# EAGLE schematic eletrio01 (EAGLE 7.3.0)

## Sheet 1 of 2
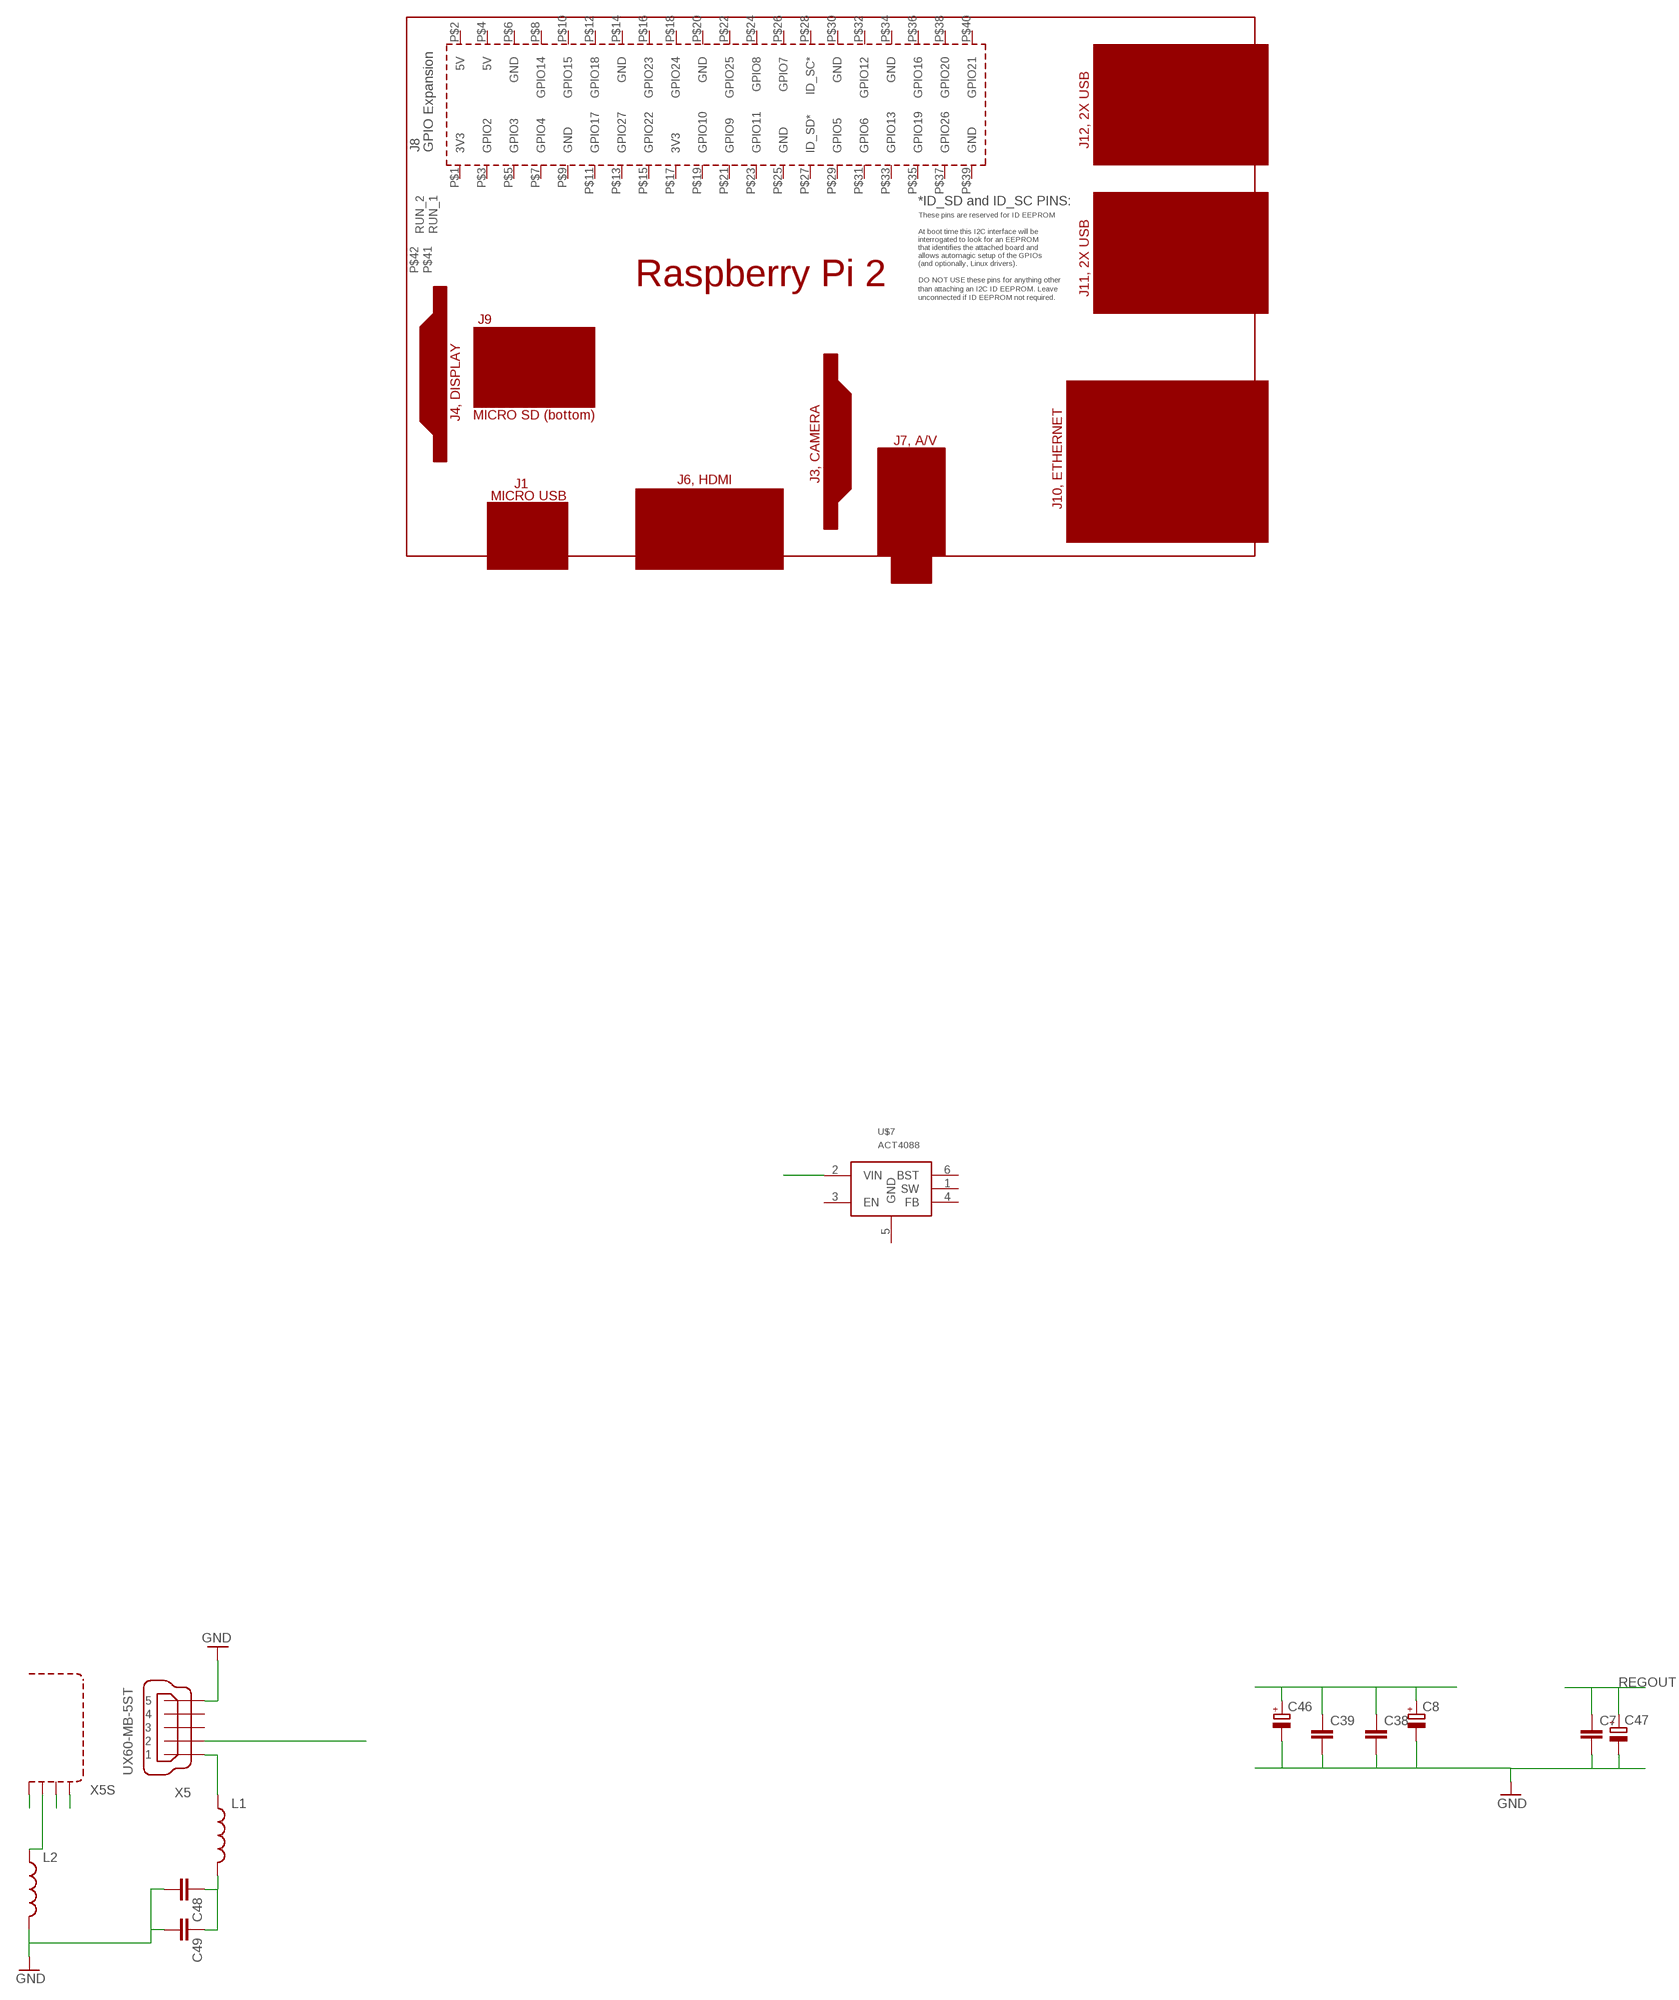
[diagram p0: schematic, sheet 1, part 1 of 3]
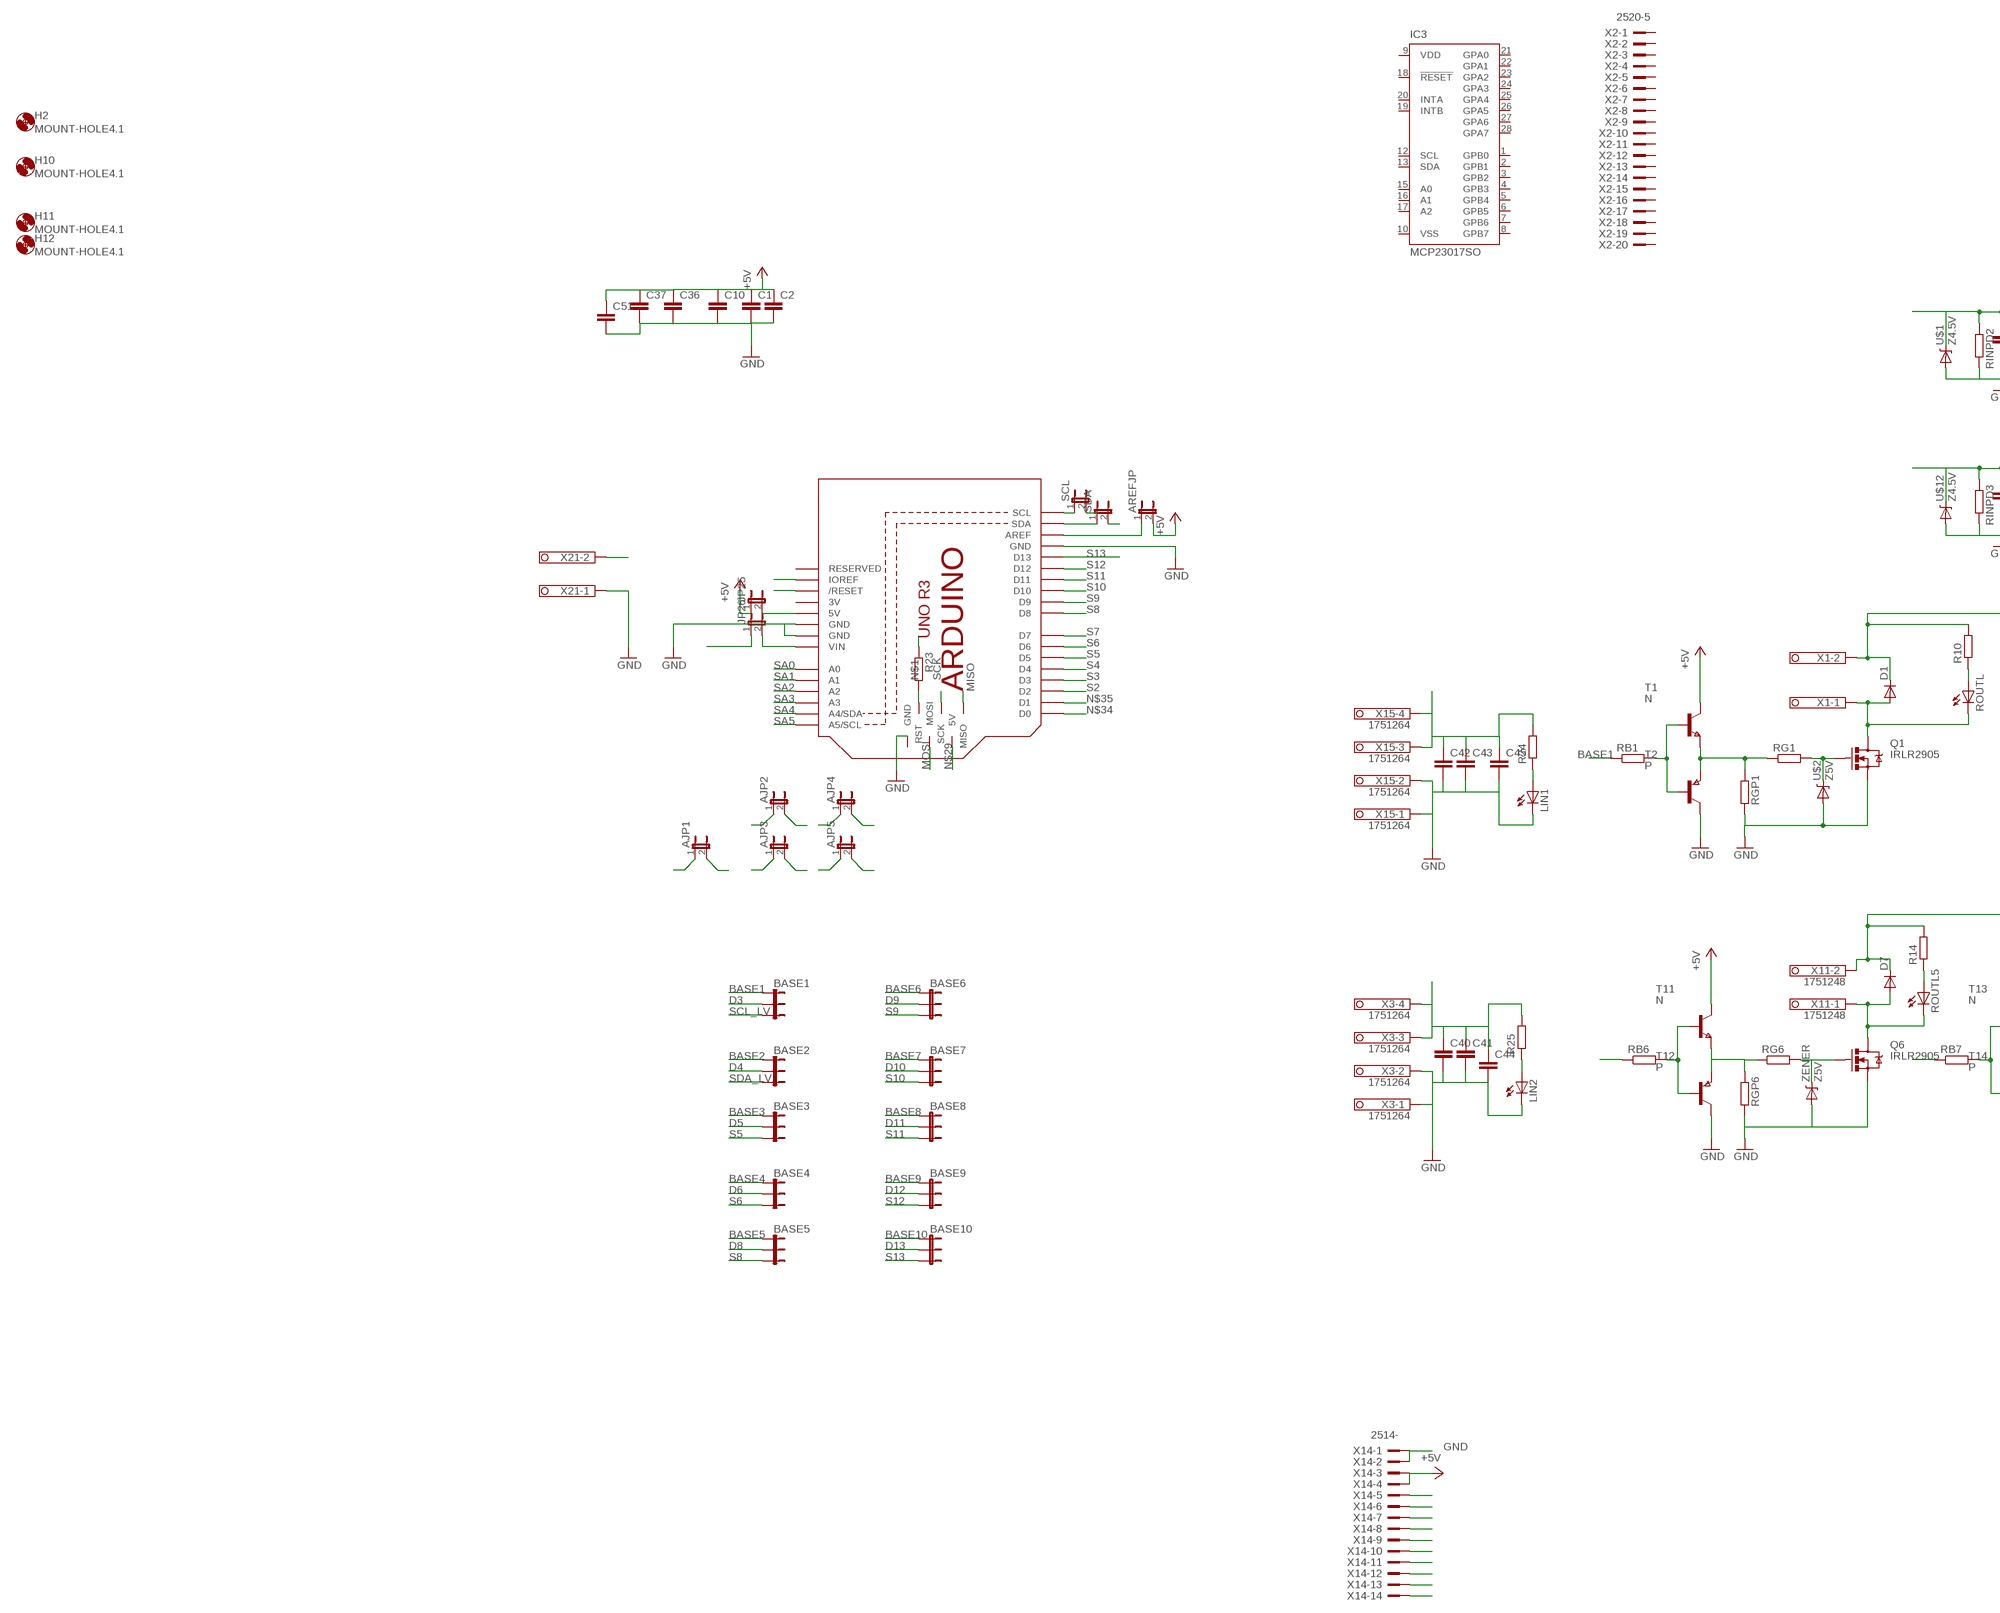
[diagram p1: schematic, sheet 1, part 2 of 3]
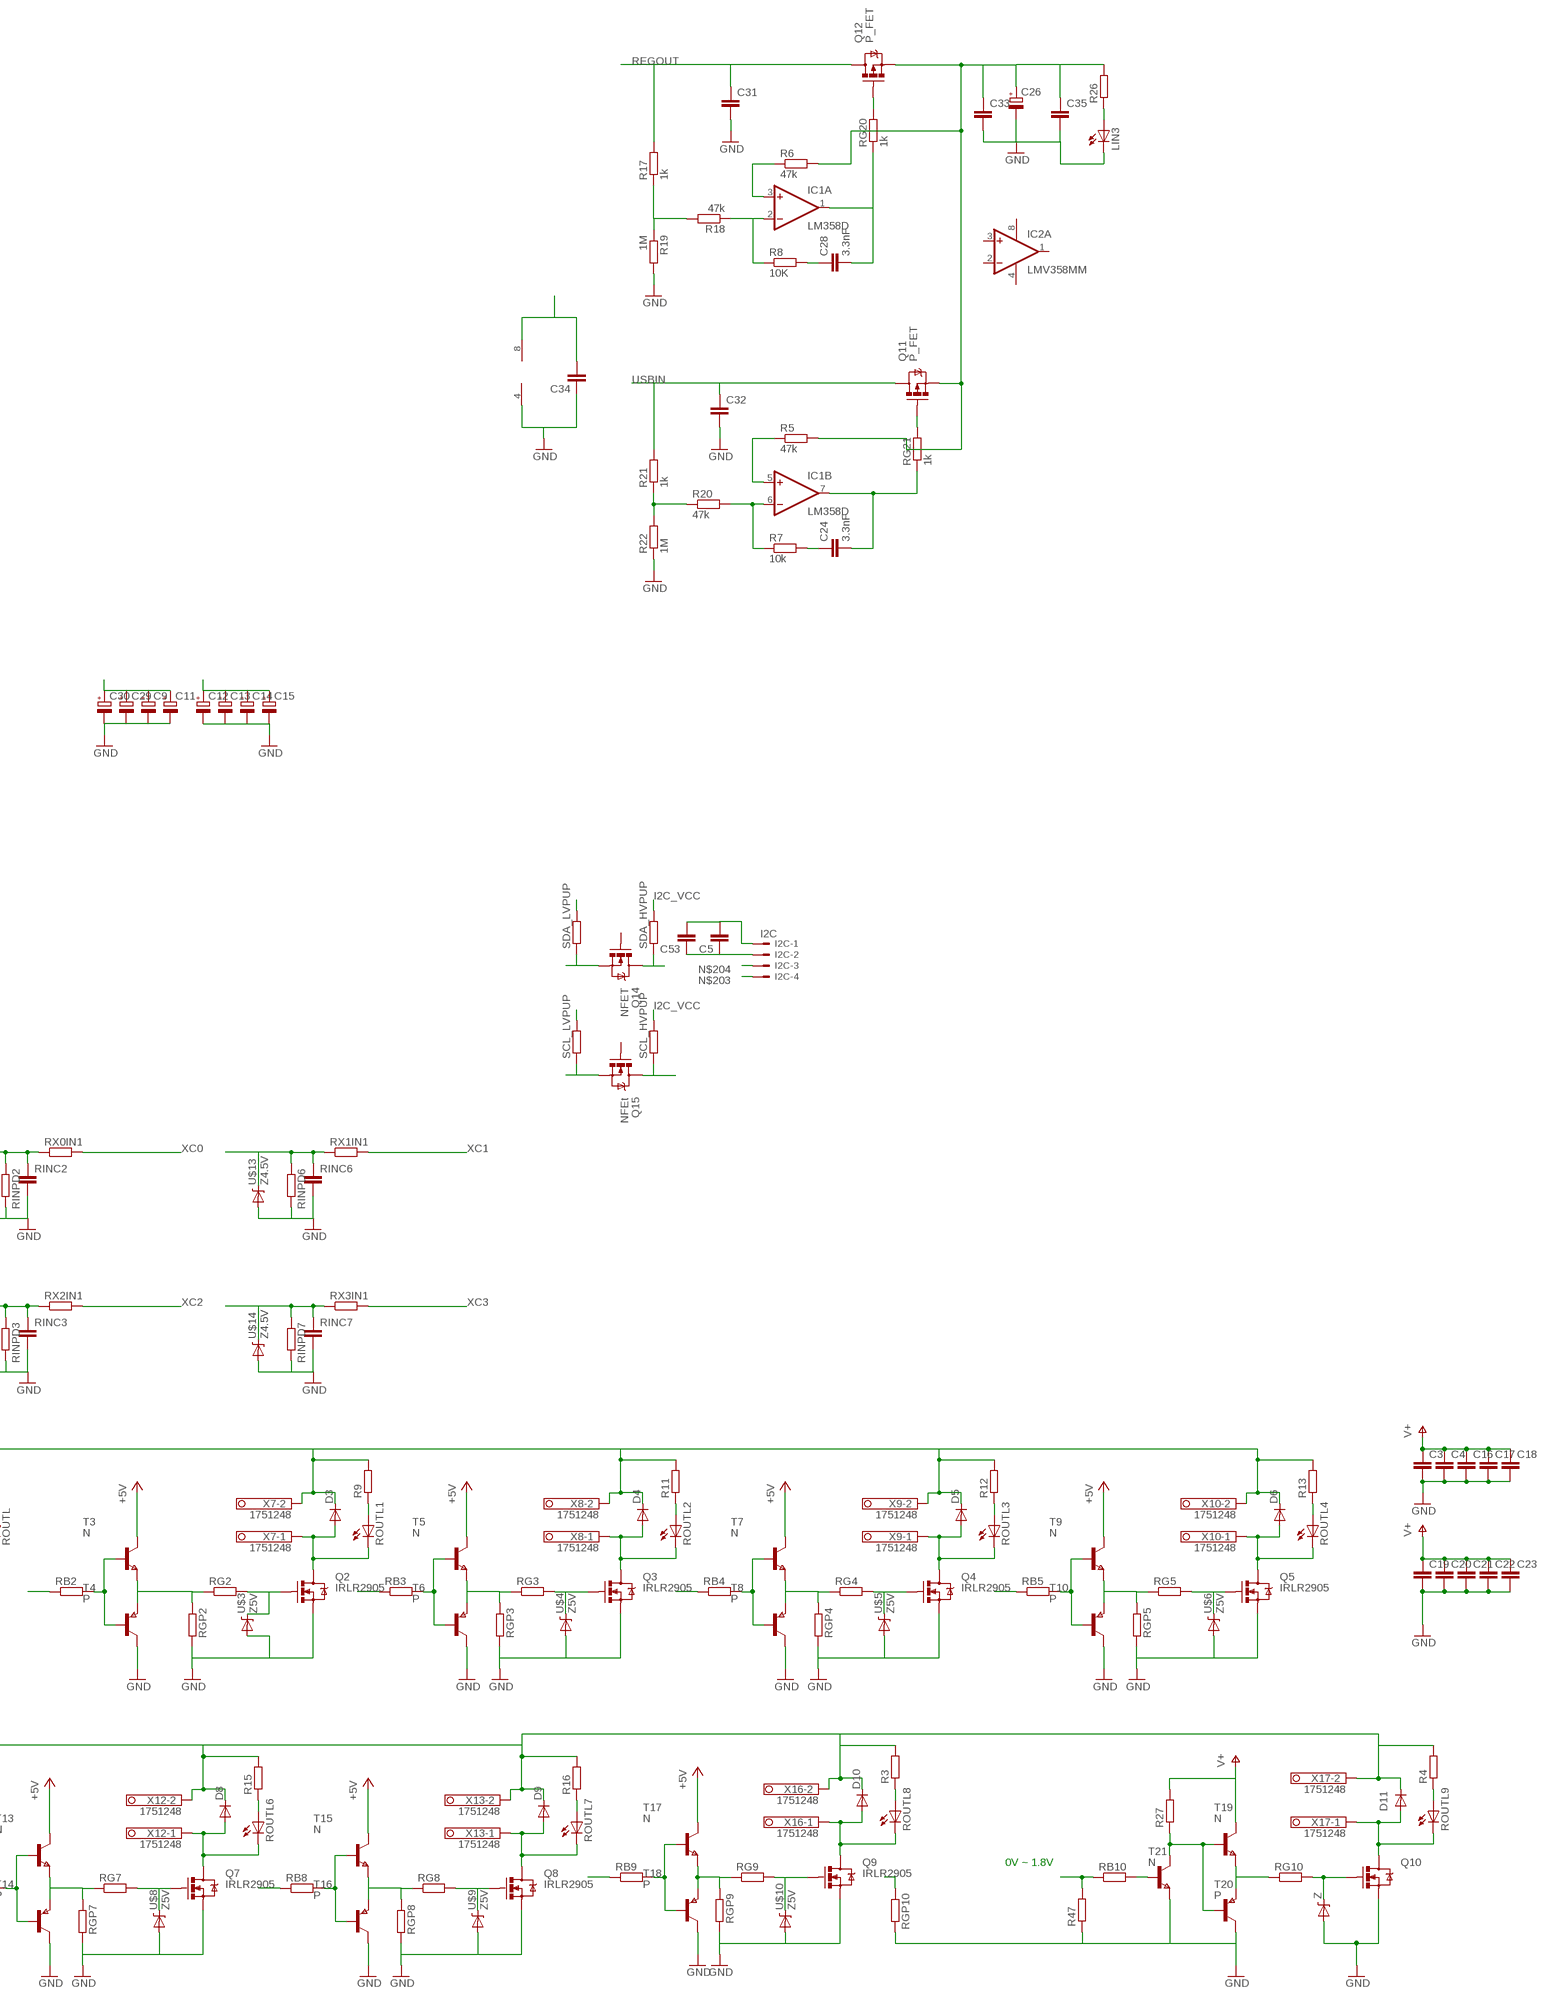
[diagram p2: schematic, sheet 1, part 3 of 3]

### Parts
AJP1  JUMPER-2SMD-NC  [SJ_2S]
AJP2  JUMPER-2SMD-NC  [SJ_2S]
AJP3  JUMPER-2SMD-NC  [SJ_2S]
AJP4  JUMPER-2SMD-NC  [SJ_2S]
AJP5  JUMPER-2SMD-NC  [SJ_2S]
AREFJP  JUMPER-2SMD-NC  [SJ_2S]
BASE1  JUMPER-3PTH  [1X03]
BASE2  JUMPER-3PTH  [1X03]
BASE3  JUMPER-3PTH  [1X03]
BASE4  JUMPER-3PTH  [1X03]
BASE5  JUMPER-3PTH  [1X03]
BASE6  JUMPER-3PTH  [1X03]
BASE7  JUMPER-3PTH  [1X03]
BASE8  JUMPER-3PTH  [1X03]
BASE9  JUMPER-3PTH  [1X03]
BASE10  JUMPER-3PTH  [1X03]
C1  C-EUC0805  [C0805]
C2  C-EUC0805  [C0805]
C3  C-EUC0603  [C0603]
C4  C-EUC0603  [C0603]
C5  C-EUC0805  [C0805]
C7  C-EUC0805  [C0805]
C8  CPOL-EUUD-6,3X8,8  [UD-6,3X5,8_NICHICON]
C9  CPOL-EUF  [PANASONIC_F]
C10  C-EUC0805  [C0805]
C11  CPOL-EUF  [PANASONIC_F]
C12  CPOL-EUF  [PANASONIC_F]
C13  CPOL-EUF  [PANASONIC_F]
C14  CPOL-EUF  [PANASONIC_F]
C15  CPOL-EUF  [PANASONIC_F]
C16  C-EUC0603  [C0603]
C17  C-EUC0603  [C0603]
C18  C-EUC0603  [C0603]
C19  C-EUC0603  [C0603]
C20  C-EUC0603  [C0603]
C21  C-EUC0603  [C0603]
C22  C-EUC0603  [C0603]
C23  C-EUC0603  [C0603]
C24  3.3nF  C-EUC0603  [C0603]
C26  CPOL-EUUD-6,3X8,8  [UD-6,3X5,8_NICHICON]
C28  3.3nF  C-EUC0603  [C0603]
C29  CPOL-EUF  [PANASONIC_F]
C30  CPOL-EUF  [PANASONIC_F]
C31  C-EUC0805  [C0805]
C32  C-EUC0805  [C0805]
C33  C-EUC0805  [C0805]
C34  C-EUC0805  [C0805]
C35  C-EUC1210  [C1210]
C36  C-EUC1210  [C1210]
C37  C-EUC0805  [C0805]
C38  C-EUC0805  [C0805]
C39  C-EUC0805  [C0805]
C40  C-EUC0805  [C0805]
C41  C-EUC0805  [C0805]
C42  C-EUC0805  [C0805]
C43  C-EUC0805  [C0805]
C44  C-EU075-032X103  [C075-032X103]
C45  C-EU075-032X103  [C075-032X103]
C46  CPOL-EUUD-6,3X8,8  [UD-6,3X5,8_NICHICON]
C47  CPOL-EUUD-6,3X8,8  [UD-6,3X5,8_NICHICON]
C48  C-EUC0805  [C0805]
C49  C-EUC1210  [C1210]
C51  C-EUC1210  [C1210]
C53  C-EUC0805  [C0805]
D1  DIODESMA-ALT  [SMA-DIODE_ALT]
D3  DIODESMA-ALT  [SMA-DIODE_ALT]
D4  DIODESMA-ALT  [SMA-DIODE_ALT]
D5  DIODESMA-ALT  [SMA-DIODE_ALT]
D6  DIODESMA-ALT  [SMA-DIODE_ALT]
D7  DIODESMA-ALT  [SMA-DIODE_ALT]
D8  DIODESMA-ALT  [SMA-DIODE_ALT]
D9  DIODESMA-ALT  [SMA-DIODE_ALT]
D10  DIODESMA-ALT  [SMA-DIODE_ALT]
D11  DIODESMA-ALT  [SMA-DIODE_ALT]
H2  MOUNT-HOLE4.1  [4,1]
H10  MOUNT-HOLE4.1  [4,1]
H11  MOUNT-HOLE4.1  [4,1]
H12  MOUNT-HOLE4.1  [4,1]
I2C  I2C  22-23-2041  [22-23-2041]
IC1  LM358D  [SO08]
IC2  LMV358MM  [MSOP08]
IC3  MCP23017SO  [SO28W]
JP25  JUMPER-2SMD-NC  [SJ_2S]
JP26  JUMPER-2SMD-NC  [SJ_2S]
L1  INDUCTOR0805  [0805]
L2  INDUCTOR0805  [0805]
LIN1  LEDCHIP-LED0805  [CHIP-LED0805]
LIN2  LEDCHIP-LED0805  [CHIP-LED0805]
LIN3  LEDCHIP-LED0805  [CHIP-LED0805]
M1  ARDUINO_R3_ICSP  [ARDUINOR3_ICSP]
PCB1  RPI2  [RPI2]
Q1  IRLR2905  MOSFET-NCHANNELFDD8780  [DPAK]
Q2  IRLR2905  MOSFET-NCHANNELFDD8780  [DPAK]
Q3  IRLR2905  MOSFET-NCHANNELFDD8780  [DPAK]
Q4  IRLR2905  MOSFET-NCHANNELFDD8780  [DPAK]
Q5  IRLR2905  MOSFET-NCHANNELFDD8780  [DPAK]
Q6  IRLR2905  MOSFET-NCHANNELFDD8780  [DPAK]
Q7  IRLR2905  MOSFET-NCHANNELFDD8780  [DPAK]
Q8  IRLR2905  MOSFET-NCHANNELFDD8780  [DPAK]
Q9  IRLR2905  MOSFET-NCHANNELFDD8780  [DPAK]
Q10  MOSFET-NCHANNELSI7820DN  [POWERPAK1212-8]
Q11  P_FET  MOSFET-PCHANNELSMD  [SOT23-3]
Q12  P_FET  MOSFET-PCHANNELSMD  [SOT23-3]
Q14  NFET  MOSFET-NCHANNELBSS138  [SOT23]
Q15  NFEt  MOSFET-NCHANNELBSS138  [SOT23]
R3  R-EU_R0603  [R0603]
R4  R-EU_R0603  [R0603]
R5  47k  R-EU_R0603  [R0603]
R6  47k  R-EU_R0603  [R0603]
R7  10k  R-EU_R0603  [R0603]
R8  10K  R-EU_R0603  [R0603]
R9  R-EU_R0603  [R0603]
R10  R-EU_R0603  [R0603]
R11  R-EU_R0603  [R0603]
R12  R-EU_R0603  [R0603]
R13  R-EU_R0603  [R0603]
R14  R-EU_R0603  [R0603]
R15  R-EU_R0603  [R0603]
R16  R-EU_R0603  [R0603]
R17  1k  R-EU_R0603  [R0603]
R18  47k  R-EU_R0603  [R0603]
R19  1M  R-EU_R0603  [R0603]
R20  47k  R-EU_R0603  [R0603]
R21  1k  R-EU_R0603  [R0603]
R22  1M  R-EU_R0603  [R0603]
R23  R-EU_R0603  [R0603]
R24  R-EU_R0603  [R0603]
R25  R-EU_R0603  [R0603]
R26  R-EU_R0603  [R0603]
R27  R-EU_R0603  [R0603]
R47  R-EU_R0603  [R0603]
RB1  R-EU_R0603  [R0603]
RB2  R-EU_R0603  [R0603]
RB3  R-EU_R0603  [R0603]
RB4  R-EU_R0603  [R0603]
RB5  R-EU_R0603  [R0603]
RB6  R-EU_R0603  [R0603]
RB7  R-EU_R0603  [R0603]
RB8  R-EU_R0603  [R0603]
RB9  R-EU_R0603  [R0603]
RB10  R-EU_R0603  [R0603]
RG1  R-EU_R0603  [R0603]
RG2  R-EU_R0603  [R0603]
RG3  R-EU_R0603  [R0603]
RG4  R-EU_R0603  [R0603]
RG5  R-EU_R0603  [R0603]
RG6  R-EU_R0603  [R0603]
RG7  R-EU_R0603  [R0603]
RG8  R-EU_R0603  [R0603]
RG9  R-EU_R0603  [R0603]
RG10  R-EU_R0603  [R0603]
RG20  1k  R-EU_R0603  [R0603]
RG21  1k  R-EU_R0603  [R0603]
RGP1  R-EU_R0603  [R0603]
RGP2  R-EU_R0603  [R0603]
RGP3  R-EU_R0603  [R0603]
RGP4  R-EU_R0603  [R0603]
RGP5  R-EU_R0603  [R0603]
RGP6  R-EU_R0603  [R0603]
RGP7  R-EU_R0603  [R0603]
RGP8  R-EU_R0603  [R0603]
RGP9  R-EU_R0603  [R0603]
RGP10  R-EU_R0603  [R0603]
RINC2  C-EUC0805  [C0805]
RINC3  C-EUC0805  [C0805]
RINC6  C-EUC0805  [C0805]
RINC7  C-EUC0805  [C0805]
RINPD2  R-EU_R0603  [R0603]
RINPD3  R-EU_R0603  [R0603]
RINPD6  R-EU_R0603  [R0603]
RINPD7  R-EU_R0603  [R0603]
ROUTL  LEDCHIP-LED0805  [CHIP-LED0805]
ROUTL1  LEDCHIP-LED0805  [CHIP-LED0805]
ROUTL2  LEDCHIP-LED0805  [CHIP-LED0805]
ROUTL3  LEDCHIP-LED0805  [CHIP-LED0805]
ROUTL4  LEDCHIP-LED0805  [CHIP-LED0805]
ROUTL5  LEDCHIP-LED0805  [CHIP-LED0805]
ROUTL6  LEDCHIP-LED0805  [CHIP-LED0805]
ROUTL7  LEDCHIP-LED0805  [CHIP-LED0805]
ROUTL8  LEDCHIP-LED0805  [CHIP-LED0805]
ROUTL9  LEDCHIP-LED0805  [CHIP-LED0805]
RX0IN1  R-EU_R0805  [R0805]
RX1IN1  R-EU_R0805  [R0805]
RX2IN1  R-EU_R0805  [R0805]
RX3IN1  R-EU_R0805  [R0805]
SCL  JUMPER-2SMD-NC  [SJ_2S]
SCL_HVPUP  R-EU_R0805  [R0805]
SCL_LVPUP  R-EU_R0805  [R0805]
SDA  JUMPER-2SMD-NC  [SJ_2S]
SDA_HVPUP  R-EU_R0805  [R0805]
SDA_LVPUP  R-EU_R0805  [R0805]
T1  N  NPNSOT323  [SOT323]
T2  P  PNPSOT323  [SOT323]
T3  N  NPNSOT323  [SOT323]
T4  P  PNPSOT323  [SOT323]
T5  N  NPNSOT323  [SOT323]
T6  P  PNPSOT323  [SOT323]
T7  N  NPNSOT323  [SOT323]
T8  P  PNPSOT323  [SOT323]
T9  N  NPNSOT323  [SOT323]
T10  P  PNPSOT323  [SOT323]
T11  N  NPNSOT323  [SOT323]
T12  P  PNPSOT323  [SOT323]
T13  N  NPNSOT323  [SOT323]
T14  P  PNPSOT323  [SOT323]
T15  N  NPNSOT323  [SOT323]
T16  P  PNPSOT323  [SOT323]
T17  N  NPNSOT323  [SOT323]
T18  P  PNPSOT323  [SOT323]
T19  N  NPNSOT323  [SOT323]
T20  P  PNPSOT323  [SOT323]
T21  N  NPNSOT323  [SOT323]
U$1  Z4.5V  DIODE-ZENER-BZT52  [SOD-323]
U$2  Z5V  DIODE-ZENER-BZT52  [SOD-323]
U$3  Z5V  DIODE-ZENER-BZT52  [SOD-323]
U$4  Z5V  DIODE-ZENER-BZT52  [SOD-323]
U$5  Z5V  DIODE-ZENER-BZT52  [SOD-323]
U$6  Z5V  DIODE-ZENER-BZT52  [SOD-323]
U$7  ACT4088  [SOT23-6]
U$8  Z5V  DIODE-ZENER-BZT52  [SOD-323]
U$9  Z5V  DIODE-ZENER-BZT52  [SOD-323]
U$10  Z5V  DIODE-ZENER-BZT52  [SOD-323]
U$12  Z4.5V  DIODE-ZENER-BZT52  [SOD-323]
U$13  Z4.5V  DIODE-ZENER-BZT52  [SOD-323]
U$14  Z4.5V  DIODE-ZENER-BZT52  [SOD-323]
X1  1751248  [1751248]
X2  2520-5  [PAK100/2500-5-20]
X3  1751264  [1751264]
X5  UX60-MB-5ST  MINI-USB-SHIELD-UX60-MB-5ST  [UX60-MB-5ST]
X7  1751248  [1751248]
X8  1751248  [1751248]
X9  1751248  [1751248]
X10  1751248  [1751248]
X11  1751248  [1751248]
X12  1751248  [1751248]
X13  1751248  [1751248]
X14  2514-  [PAK100/2500-14]
X15  1751264  [1751264]
X16  1751248  [1751248]
X17  1751248  [1751248]
X21  1751248  [1751248]
Z  DIODE-ZENER-BZT52  [SOD-323]
ZENER  Z5V  DIODE-ZENER-BZT52  [SOD-323]

### Nets
+5V: AREFJP.2 C1.1 C2.1 C10.1 C26.+ C33.1 C34.2 C35.1 C36.1 C37.1 C51.1 IC1.8(P:V+) JP25.1 Q11.2(S) Q12.2(S) R5.2 R6.2 R26.2 T1.1(C) T3.1(C) T5.1(C) T7.1(C) T9.1(C) T11.1(C) T13.1(C) T15.1(C) T17.1(C) X14.3 X14.4
A1: AJP1.2
A2: AJP2.2
A3: AJP3.2
A4: AJP4.2 SDA.2
A5: AJP5.2 SCL.2
ARDVIN: C8.+ C38.1 C39.1 C46.+ JP26.1 X21.2
BASE1: BASE1.1 RB1.1 X14.5
BASE2: BASE2.1 RB2.1 X14.6
BASE3: BASE3.1 RB3.1 X14.7
BASE4: BASE4.1 RB4.1 X14.8
BASE5: BASE5.1 RB5.1 X14.9
BASE6: BASE6.1 RB6.1 X14.10
BASE7: BASE7.1 RB7.1 X14.11
BASE8: BASE8.1 RB8.1 X14.12
BASE9: BASE9.1 RB9.1 X14.13
BASE10: BASE10.1 RGP10.1 X14.14
D3: BASE1.2
D4: BASE2.2
D5: BASE3.2
D6: BASE4.2
D8: BASE5.2
D9: BASE6.2
D10: BASE7.2
D11: BASE8.2
D12: BASE9.2
D13: BASE10.2
GND: C3.2 C4.2 C5.2 C7.2 C8.- C9.- C11.- C12.- C13.- C14.- C15.- C16.2 C17.2 C18.2 C19.2 C20.2 C21.2 C22.2 C23.2 C26.- C29.- C30.- C31.2 C32.2 C33.2 C34.1 C35.2 C38.2 C39.2 C40.2 C41.2 C42.2 C43.2 C44.2 C45.2 C46.- C47.- C48.2 C49.2 C53.2 I2C.1 IC1.4(P:V-) L2.2 LIN1.C LIN2.C LIN3.C M1.GND M1.GND@1(GND) M1.GND@3(GND) Q1.3(S) Q2.3(S) Q3.3(S) Q4.3(S) Q5.3(S) Q6.3(S) Q7.3(S) Q8.3(S) Q9.3(S) Q10.S1(S) Q10.S2(S) Q10.S3(S) R19.2 R22.1 R47.1 RGP1.2 RGP2.2 RGP3.2 RGP4.2 RGP5.2 RGP6.2 RGP7.2 RGP8.2 RGP9.2 RGP10.2 RINC2.2 RINC3.2 RINC6.2 RINC7.2 RINPD2.2 RINPD3.2 RINPD6.2 RINPD7.2 T2.1(C) T4.1(C) T6.1(C) T8.1(C) T10.1(C) T12.1(C) T14.1(C) T16.1(C) T18.1(C) T20.1(C) T21.3(E) U$1.2(A) U$2.2(A) U$3.2(A) U$4.2(A) U$5.2(A) U$6.2(A) U$8.2(A) U$9.2(A) U$10.2(A) U$12.2(A) U$13.2(A) U$14.2(A) X3.1 X3.2 X5.5 X14.1 X14.2 X15.1 X15.2 X21.1 Z.2(A) ZENER.2(A) ; also sheet 2
I2C_VCC: C5.1 C53.1 I2C.2 SCL_HVPUP.2 SDA_HVPUP.2
MISO: M1.MISO
MOSI: M1.MOSI
N$1: M1.RESET_ICSP(RST) R23.2
N$5: C1.2 C2.2 C10.2 C36.2 C37.2 C51.2
N$7: U$7.2(VIN)
N$10: RB10.2 T21.2(B)
N$12: L2.1 X5.M2(S2)
N$14: IC1.5(B:+IN) R5.1
N$15: LIN1.A R24.1
N$16: M1.SCL SCL.1
N$17: AREFJP.1 M1.AREF
N$18: JP25.2 M1.5V
N$20: R47.2 RB10.1
N$21: C24.2 IC1.7(B:OUT) RG21.1
N$23: SCL_LVPUP.2
N$25: IC1.3(A:+IN) R6.1
N$26: M1.SDA SDA.1
N$27: SDA_LVPUP.2
N$28: IC1.6(B:-IN) R7.1 R20.2
N$29: M1.5V_ICSP(5V)
N$30: IC1.2(A:-IN) R8.1 R18.1
N$31: C28.1 R8.2
N$32: C24.1 R7.2
N$33: R17.1 R18.2 R19.1
N$34: M1.D0
N$35: M1.D1
N$36: LIN2.A R25.1
N$37: X5.2
N$44: LIN3.A R26.1
N$45: L1.1 X5.1
N$46: R20.1 R21.1 R22.2
N$48: JP26.2 M1.VIN
N$49: M1.RESET(/RESET)
N$50: M1.IOREF
N$53: D3.A Q2.4(D) ROUTL1.C X7.1
N$54: Q2.1(G) RG2.2 U$3.1(C)
N$57: R9.1 ROUTL1.A
N$58: D4.A Q3.4(D) ROUTL2.C X8.1
N$61: Q3.1(G) RG3.2 U$4.1(C)
N$62: R11.1 ROUTL2.A
N$64: Q11.1(G) RG21.2
N$65: Q1.1(G) RG1.2 U$2.1(C)
N$66: Q4.1(G) RG4.2 U$5.1(C)
N$67: Q12.1(G) RG20.2
N$69: R12.1 ROUTL3.A
N$70: D6.A Q5.4(D) ROUTL4.C X10.1
N$73: Q5.1(G) RG5.2 U$6.1(C)
N$74: R13.1 ROUTL4.A
N$83: C28.2 IC1.1(A:OUT) RG20.1
N$90: D1.A Q1.4(D) ROUTL.C X1.1
N$95: R10.1 ROUTL.A
N$96: RB1.2 T1.2(B) T2.2(B)
N$97: RB2.2 T3.2(B) T4.2(B)
N$98: D10.A Q9.4(D) ROUTL8.C X16.1
N$100: Q9.1(G) RG9.2 U$10.1(C)
N$101: R3.1 ROUTL8.A
N$102: D11.A Q10.D1(D) Q10.D2(D) Q10.D3(D) Q10.D4(D) Q10.DPAD(D) ROUTL9.C X17.1
N$103: Q10.G RG10.2 Z.1(C)
N$104: R4.1 ROUTL9.A
N$105: RG1.1 RGP1.1 T1.3(E) T2.3(E)
N$108: RB3.2 T5.2(B) T6.2(B)
N$114: RB4.2 T7.2(B) T8.2(B)
N$117: RB5.2 T9.2(B) T10.2(B)
N$120: RB6.2 T11.2(B) T12.2(B)
N$123: RB7.2 T13.2(B) T14.2(B)
N$126: RB8.2 T15.2(B) T16.2(B)
N$127: D7.A Q6.4(D) ROUTL5.C X11.1
N$130: RB9.2 T17.2(B) T18.2(B)
N$133: R27.1 T19.2(B) T20.2(B) T21.1(C)
N$141: Q6.1(G) RG6.2 ZENER.1(C)
N$142: R14.1 ROUTL5.A
N$143: D8.A Q7.4(D) ROUTL6.C X12.1
N$144: Q7.1(G) RG7.2 U$8.1(C)
N$145: R15.1 ROUTL6.A
N$146: D9.A Q8.4(D) ROUTL7.C X13.1
N$147: Q8.1(G) RG8.2 U$9.1(C)
N$148: R16.1 ROUTL7.A
N$203: I2C.4
N$204: I2C.3
POWERBUS_A: C9.+ C11.+ C29.+ C30.+ C40.1 C41.1 C44.1 D7.C D8.C D9.C D10.C D11.C R3.2 R4.2 R14.2 R15.2 R16.2 R25.2 X3.3 X3.4 X11.2 X12.2 X13.2 X16.2 X17.2
POWERBUS_B: C12.+ C13.+ C14.+ C15.+ C42.1 C43.1 C45.1 D1.C D3.C D4.C D5.C D6.C R9.2 R10.2 R11.2 R12.2 R13.2 R24.2 X1.2 X7.2 X8.2 X9.2 X10.2 X15.3 X15.4
Q4: D5.A Q4.4(D) ROUTL3.C X9.1
REGOUT: C7.1 C31.1 C47.+ Q12.3(D) R17.2
RG1: RG9.1 RGP9.1 T17.3(E) T18.3(E)
RG2: RG2.1 RGP2.1 T3.3(E) T4.3(E)
RG3: RG3.1 RGP3.1 T5.3(E) T6.3(E)
RG4: RG4.1 RGP4.1 T7.3(E) T8.3(E)
RG5: RG5.1 RGP5.1 T9.3(E) T10.3(E)
RG6: RG6.1 RGP6.1 T11.3(E) T12.3(E)
RG7: RG7.1 RGP7.1 T13.3(E) T14.3(E)
RG8: RG8.1 RGP8.1 T15.3(E) T16.3(E)
RG9: RG10.1 T19.3(E) T20.3(E)
RST: R23.1
S2: M1.D2
S3: M1.D3
S4: M1.D4
S5: BASE3.3 M1.D5
S6: BASE4.3 M1.D6
S7: M1.D7
S8: BASE5.3 M1.D8
S9: BASE6.3 M1.D9
S10: BASE7.3 M1.D10
S11: BASE8.3 M1.D11
S12: BASE9.3 M1.D12
S13: BASE10.3 M1.D13
SA0: M1.A0
SA1: AJP1.1 M1.A1
SA2: AJP2.1 M1.A2
SA3: AJP3.1 M1.A3
SA4: AJP4.1 M1.A4(A4/SDA)
SA5: AJP5.1 M1.A5(A5/SCL)
SCK: M1.SCK
SCL_LV: BASE1.3 Q15.2(S) SCL_LVPUP.1
SDA_HV: Q14.3(D) Q15.3(D) SCL_HVPUP.1 SDA_HVPUP.1
SDA_LV: BASE2.3 Q14.2(S) SDA_LVPUP.1
SHIELD1: X5.M4(S4)
SHIELD2: X5.M3(S3)
SHIELD3: X5.M1(S1)
USBIN: C32.1 C48.1 C49.1 L1.2 Q11.3(D) R21.2
V+: C3.1 C4.1 C16.1 C17.1 C18.1 C19.1 C20.1 C21.1 C22.1 C23.1 R27.2 T19.1(C)
X0: RINC2.1 RINPD2.1 RX0IN1.1 U$1.1(C)
X1: RINC6.1 RINPD6.1 RX1IN1.1 U$13.1(C)
X2: RINC3.1 RINPD3.1 RX2IN1.1 U$12.1(C)
X3: RINC7.1 RINPD7.1 RX3IN1.1 U$14.1(C)
XC0: RX0IN1.2
XC1: RX1IN1.2
XC2: RX2IN1.2
XC3: RX3IN1.2
Unconnected: IC2.1(A:OUT) IC2.2(A:-IN) IC2.3(A:+IN) IC2.5(B:+IN) IC2.6(B:-IN) IC2.7(B:OUT) IC3.1(GPB0) IC3.2(GPB1) IC3.3(GPB2) IC3.4(GPB3) IC3.5(GPB4) IC3.6(GPB5) IC3.7(GPB6) IC3.8(GPB7) IC3.12(SCL) IC3.13(SDA) IC3.15(A0) IC3.16(A1) IC3.17(A2) IC3.18(!RESET) IC3.19(INTB) IC3.20(INTA) IC3.21(GPA0) IC3.22(GPA1) IC3.23(GPA2) IC3.24(GPA3) IC3.25(GPA4) IC3.26(GPA5) IC3.27(GPA6) IC3.28(GPA7) M1.GND@2(GND) M1.RESERVED PCB1.P$1(3V3) PCB1.P$2(5V) PCB1.P$3(GPIO2) PCB1.P$4(5V) PCB1.P$5(GPIO3) PCB1.P$6(GND) PCB1.P$7(GPIO4) PCB1.P$8(GPIO14) PCB1.P$9(GND) PCB1.P$10(GPIO15) PCB1.P$11(GPIO17) PCB1.P$12(GPIO18) PCB1.P$13(GPIO27) PCB1.P$14(GND) PCB1.P$15(GPIO22) PCB1.P$16(GPIO23) PCB1.P$17(3V3) PCB1.P$18(GPIO24) PCB1.P$19(GPIO10) PCB1.P$20(GND) PCB1.P$21(GPIO9) PCB1.P$22(GPIO25) PCB1.P$23(GPIO11) PCB1.P$24(GPIO8) PCB1.P$25(GND) PCB1.P$26(GPIO7) PCB1.P$27(ID_SD*) PCB1.P$28(ID_SC*) PCB1.P$29(GPIO5) PCB1.P$30(GND) PCB1.P$31(GPIO6) PCB1.P$32(GPIO12) PCB1.P$33(GPIO13) PCB1.P$34(GND) PCB1.P$35(GPIO19) PCB1.P$36(GPIO16) PCB1.P$37(GPIO26) PCB1.P$38(GPIO20) PCB1.P$39(GND) PCB1.P$40(GPIO21) PCB1.P$41(RUN_1) PCB1.P$42(RUN_2) Q14.1(G) Q15.1(G) U$7.1(SW) U$7.3(EN) U$7.4(FB) U$7.5(GND) U$7.6(BST) X2.1 X2.2 X2.3 X2.4 X2.5 X2.6 X2.7 X2.8 X2.9 X2.10 X2.11 X2.12 X2.13 X2.14 X2.15 X2.16 X2.17 X2.18 X2.19 X2.20 X5.3 X5.4

### Notes on the sheet
- 0V ~ 1.8V

## Sheet 2 of 2
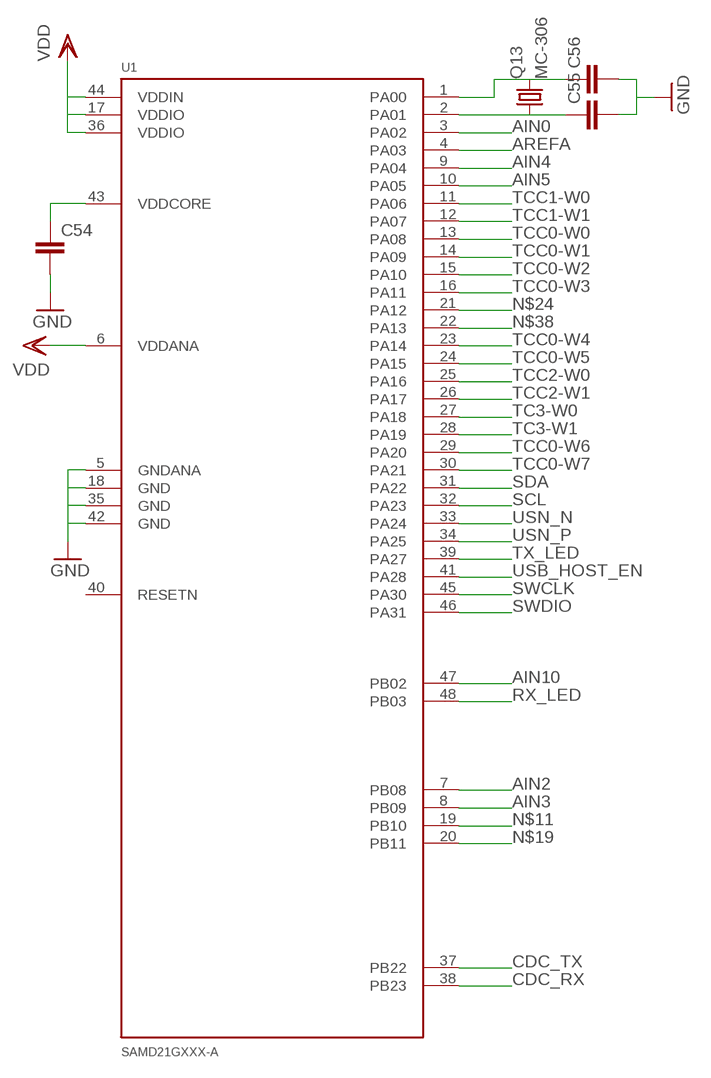
[diagram p3: schematic, sheet 2]

### Parts
C54  C-EUC0603  [C0603]
C55  C-EUC0603  [C0603]
C56  C-EUC0603  [C0603]
Q13  MC-306  [MC-306]
U1  SAMD21GXXX-A  [TQFP48]

### Nets
AIN0: U1.3(PA02)
AIN2: U1.7(PB08)
AIN3: U1.8(PB09)
AIN4: U1.9(PA04)
AIN5: U1.10(PA05)
AIN10: U1.47(PB02)
AREFA: U1.4(PA03)
CDC_RX: U1.38(PB23)
CDC_TX: U1.37(PB22)
GND: C54.2 C55.2 C56.2 U1.5(GNDANA) U1.18(GND) U1.35(GND) U1.42(GND) ; also sheet 1
N$2: C55.1 Q13.1 U1.2(PA01)
N$6: C56.1 Q13.4 U1.1(PA00)
N$11: U1.19(PB10)
N$19: U1.20(PB11)
N$24: U1.21(PA12)
N$38: U1.22(PA13)
RX_LED: U1.48(PB03)
SCL: U1.32(PA23)
SDA: U1.31(PA22)
SWCLK: U1.45(PA30)
SWDIO: U1.46(PA31)
TC3-W0: U1.27(PA18)
TC3-W1: U1.28(PA19)
TCC0-W0: U1.13(PA08)
TCC0-W1: U1.14(PA09)
TCC0-W2: U1.15(PA10)
TCC0-W3: U1.16(PA11)
TCC0-W4: U1.23(PA14)
TCC0-W5: U1.24(PA15)
TCC0-W6: U1.29(PA20)
TCC0-W7: U1.30(PA21)
TCC1-W0: U1.11(PA06)
TCC1-W1: U1.12(PA07)
TCC2-W0: U1.25(PA16)
TCC2-W1: U1.26(PA17)
TX_LED: U1.39(PA27)
USB_HOST_EN: U1.41(PA28)
USN_N: U1.33(PA24)
USN_P: U1.34(PA25)
VDD: U1.6(VDDANA) U1.17(VDDIO) U1.36(VDDIO) U1.44(VDDIN)
VDDCORE: C54.1 U1.43(VDDCORE)
Unconnected: U1.40(RESETN)

## Power pins joined to a net without a drawn wire
3V: M1.3V
V+: IC2.8(P:V+)
V-: IC2.4(P:V-)
VDD: IC3.9(VDD)
VSS: IC3.10(VSS)

## Library data of the parts
AJP1-AJP5 AREFJP JP25 JP26 SCL SDA = SparkFun-Passives:JUMPER-2: Jumper Basic 0.1" spaced jumper. Use with breakaway headers.
BASE1-BASE10 = SparkFun-Passives:JUMPER-3
C1-C5 C7 C10 C16-C24 C28 C31-C45 C48 C49 C51 C53-C56 RINC2 RINC3 RINC6 RINC7 = wes:C-EU: CAPACITOR, European symbol
C8 C9 C11-C15 C26 C29 C30 C46 C47 = rcl:CPOL-EU: POLARIZED CAPACITOR, European symbol
D1 D3-D11 = SparkFun-DiscreteSemi:DIODE: Diode These are standard reverse protection diodes and small signal diodes. SMA package can handle up to about 1A. SOD-323 can handle about 200mA. What the SOD-323 package when ordering, there are some mfgs out there that are 5-pin packages.
H2 H10-H12 = holes:MOUNT-HOLE: MOUNTING HOLE with drill center marker
I2C = con-molex:22-23-2041: .100" (2.54mm) Center Header - 4 Pin; MF: MOLEX; MPN: 22-23-2041; OC_FARNELL: 1462920; OC_NEWARK: 38C0355
IC1 = linear:LM358: OP AMP also LM158; LM258; LM2904 Source: http://cache.national.com/ds/LM/LM158.pdf
IC2 = linear:LMV358?*: Dual General Purpose, Low Voltage, Rail-to-Rail Output Operational Amplifiers Source: http://www.national.com/mpf/LM/LMV321.html http://www.national.com/dt/lmv_qual.pdf
IC3 = adafruit:MCP23017: http://ww1.microchip.com/downloads/en/DeviceDoc/21952a.pdf Source: http://ww1.microchip.com/downloads/en/DeviceDoc/21952a.pdf
L1 L2 = SparkFun-Passives:INDUCTOR: Inductors Basic Inductor/Choke - 0603 and 1206. Footprints are not proven and vary greatly between part numbers. SRN6045- 33uH, 20% 1.4A SDR0403-560KL - 56uH, 10%, 500mA RMS/740mA peak
LIN1-LIN3 ROUTL ROUTL1-ROUTL9 = adafruit:LED: LED OSRAM: - CHIPLED LG R971, LG N971, LY N971, LG Q971, LY Q971, LO R971, LY R971 LH N974, LH R974 LS Q976, LO Q976, LY Q976 LO Q996 - Hyper CHIPLED LW Q18S LB Q993, LB Q99A, LB R99A - SideLED LS A670, LO A670, LY A670, LG A670, LP A670 LB A673, LV A673, LT A673, LW A673 LH A674 LY A675 LS A676, LA A676, LO A676, LY A676, LW A676 LS A679, LY A679, LG A679 - Hyper Micro SIDELED® LS Y876, LA Y876, LO Y876, LY Y876 LT Y87S - SmartLED LW L88C, LW L88S LB L89C, LB L89S, LG L890 LS L89K, LO L89K, LY L89K LS L896, LA L896, LO L896, LY L896 - TOPLED LS T670, LO T670, LY T670, LG T670, LP T670 LSG T670, LSP T670, LSY T670, LOP T670, LYG T670 LG T671, LOG T671, LSG T671 LB T673, LV T673, LT T673, LW T673 LH T674 LS T676, LA T676, LO T676, LY T676, LB T676, LH T676, LSB T676, LW T676 LB T67C, LV T67C, LT T67C, LS T67K, LO T67K, LY T67K, LW E67C LS E67B, LA E67B, LO E67B, LY E67B, LB E67C, LV E67C, LT E67C LW T67C LS T679, LY T679, LG T679 LS T770, LO T770, LY T770, LG T770, LP T770 LB T773, LV T773, LT T773, LW T773 LH T774 LS E675, LA E675, LY E675, LS T675 LS T776, LA T776, LO T776, LY T776, LB T776 LHGB T686 LT T68C, LB T68C - Hyper Mini TOPLED® LB M676 - Mini TOPLED Santana® LG M470 LS M47K, LO M47K, LY M47K Source: http://www.osram.convergy.de/
M1 = adafruit:ARDUINO_R3_ICSP
PCB1 = Rpi2_RevA:RPI2: Device for Raspberry Pi 2 board created by www.element14.com More information and support community is available at http://www.element14.com/community/community/raspberry-pi/raspberrypi2
Q1-Q9 = SparkFun-DiscreteSemi:MOSFET-NCHANNEL: Common NMOSFET Parts MFG P/N Store ID Prod ID FDD8780 TRANS-09984 SI7820DN TRANS-11055 FDS6630A IC-08089 2N7002PW TRANS-11151 FQP30N06L COM-10213 TRANS-10060 BSS123LT1G TRANS-08345 BSS138 TRANS-00830 BS170 2N7000; PROD_ID: TRANS-09984
Q10 = SparkFun-DiscreteSemi:MOSFET-NCHANNEL: Common NMOSFET Parts MFG P/N Store ID Prod ID FDD8780 TRANS-09984 SI7820DN TRANS-11055 FDS6630A IC-08089 2N7002PW TRANS-11151 FQP30N06L COM-10213 TRANS-10060 BSS123LT1G TRANS-08345 BSS138 TRANS-00830 BS170 2N7000; PROD_ID: TRANS-11055
Q11 Q12 = SparkFun-DiscreteSemi:MOSFET-PCHANNEL: Generic PMOSFET
Q13 = crystal:MC-306: kHz RANGE CRYSTAL UNIT SMD Source: MC-306_405_406_E07X.PDF Homepage <http://www.epsontoyocom.co.jp>; MPN: MC-306 60.0KHZ 100PPM ,12.5PF; OC_FARNELL: 1278040; OC_NEWARK: 31M5576
Q14 Q15 = SparkFun-DiscreteSemi:MOSFET-NCHANNEL: Common NMOSFET Parts MFG P/N Store ID Prod ID FDD8780 TRANS-09984 SI7820DN TRANS-11055 FDS6630A IC-08089 2N7002PW TRANS-11151 FQP30N06L COM-10213 TRANS-10060 BSS123LT1G TRANS-08345 BSS138 TRANS-00830 BS170 2N7000; PROD_ID: TRANS-00830
R3-R27 R47 RB1-RB10 RG1-RG10 RG20 RG21 RGP1-RGP10 RINPD2 RINPD3 RINPD6 RINPD7 RX0IN1 RX1IN1 RX2IN1 RX3IN1 SCL_HVPUP SCL_LVPUP SDA_HVPUP SDA_LVPUP = wes:R-EU_: RESISTOR, European symbol
T1 T3 T5 T7 T9 T11 T13 T15 T17 T19 T21 = zetex:NPNSOT323: NPN TRANSISTOR; MPN: DSS4160U-7; OC_FARNELL: 1710696; OC_NEWARK: 25R4558
T2 T4 T6 T8 T10 T12 T14 T16 T18 T20 = zetex:PNPSOT323: PNP TRANSISTOR; MPN: 2DB1689-7; OC_FARNELL: 1710698; OC_NEWARK: 25R5667
U1 = borkedlabs-micros:SAMD21G
U$1-U$6 U$8-U$10 U$12-U$14 Z ZENER = SparkFun-DiscreteSemi:DIODE-ZENER: Zener Diode Production Part - 8199 3.4V Zener Voltage
U$7 = wes:ACT4088
X1 X7-X13 X16 X17 X21 = wes:1751248: MKDS 1/ 2-3,5 Printklemme Nennstrom: 10 A Bemessungsspannung: 160 V Raster: 3,5 mm Polzahl: 2 Montageart: Löten Anschlussart: Schraubanschluss Anschlussrichtung vom Leiter zur Platine: 0° Source: http://eshop.phoenixcontact.com .. 1751248.pdf; OC_FARNELL: unknown; OC_NEWARK: unknown
X2 = con-3m:2520-: 3M (TM) Pak 100 4-Wall Header Source: 3M; MPN: D2520-5002-AR; OC_FARNELL: unknown; OC_NEWARK: 12P7058
X3 X15 = wes:1751264: MKDS 1/ 4-3,5 Printklemme Nennstrom: 10 A Bemessungsspannung: 160 V Raster: 3,5 mm Polzahl: 4 Montageart: Löten Anschlussart: Schraubanschluss Anschlussrichtung vom Leiter zur Platine: 0° Source: http://eshop.phoenixcontact.com .. 1751264.pdf; MPN: 1751264; OC_FARNELL: unknown; OC_NEWARK: 10R0934
X5 = con-hirose:MINI-USB-SHIELD-: MINI USB Connector Source: http://www.hirose.co.jp/cataloge_hp/e24000019.pdf; OC_FARNELL: unknown; OC_NEWARK: unknown
X14 = con-3m:2514-: 3M (TM) Pak 100 4-Wall Header Source: 3M; OC_FARNELL: unknown; OC_NEWARK: unknown